# EAGLE schematic cyberspace-1-mainboard (EAGLE 9.6.2)
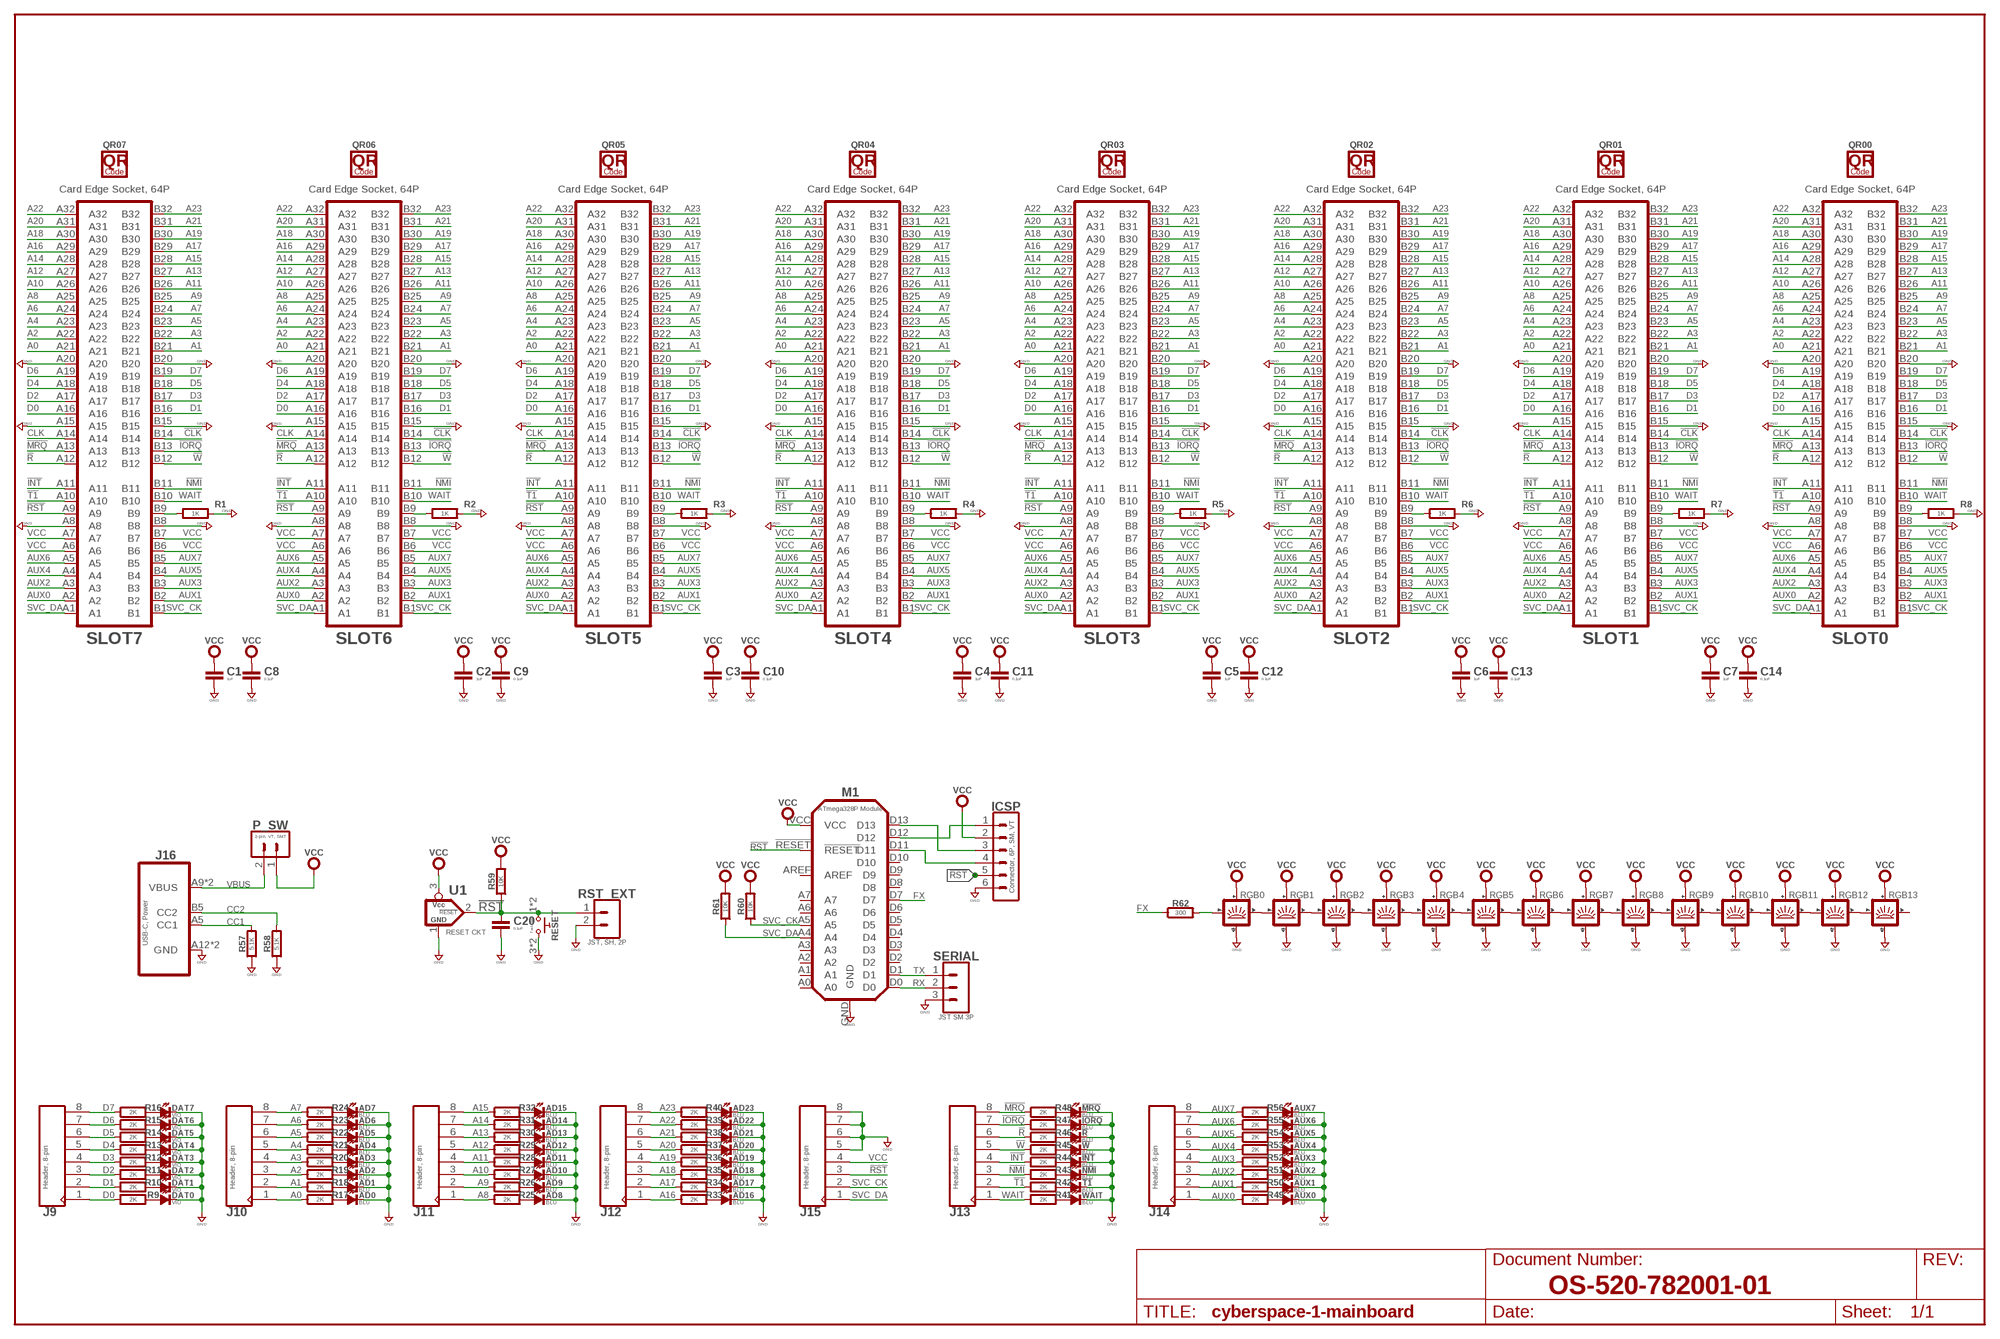
[diagram p0: schematic, sheet 1]
FRAME1 (TABL_L): DOCUMENT_NUMBER: OS-520-782001-01

## Parts
!INT  BLU  SMT0603  [SMD_0603]
!IORQ  BLU  SMT0603  [SMD_0603]
!MRQ  BLU  SMT0603  [SMD_0603]
!NMI  BLU  SMT0603  [SMD_0603]
!R  BLU  SMT0603  [SMD_0603]
!T1  BLU  SMT0603  [SMD_0603]
!W  BLU  SMT0603  [SMD_0603]
AD0  BLU  SMT0603  [SMD_0603]
AD1  BLU  SMT0603  [SMD_0603]
AD2  BLU  SMT0603  [SMD_0603]
AD3  BLU  SMT0603  [SMD_0603]
AD4  BLU  SMT0603  [SMD_0603]
AD5  BLU  SMT0603  [SMD_0603]
AD6  BLU  SMT0603  [SMD_0603]
AD7  BLU  SMT0603  [SMD_0603]
AD8  BLU  SMT0603  [SMD_0603]
AD9  BLU  SMT0603  [SMD_0603]
AD10  BLU  SMT0603  [SMD_0603]
AD11  BLU  SMT0603  [SMD_0603]
AD12  BLU  SMT0603  [SMD_0603]
AD13  BLU  SMT0603  [SMD_0603]
AD14  BLU  SMT0603  [SMD_0603]
AD15  BLU  SMT0603  [SMD_0603]
AD16  BLU  SMT0603  [SMD_0603]
AD17  BLU  SMT0603  [SMD_0603]
AD18  BLU  SMT0603  [SMD_0603]
AD19  BLU  SMT0603  [SMD_0603]
AD20  BLU  SMT0603  [SMD_0603]
AD21  BLU  SMT0603  [SMD_0603]
AD22  BLU  SMT0603  [SMD_0603]
AD23  BLU  SMT0603  [SMD_0603]
AUX0  BLU  SMT0603  [SMD_0603]
AUX1  BLU  SMT0603  [SMD_0603]
AUX2  BLU  SMT0603  [SMD_0603]
AUX3  BLU  SMT0603  [SMD_0603]
AUX4  BLU  SMT0603  [SMD_0603]
AUX5  BLU  SMT0603  [SMD_0603]
AUX6  BLU  SMT0603  [SMD_0603]
AUX7  BLU  SMT0603  [SMD_0603]
C1  1uF  CAPACITOR0603  [0603-CAP]
C2  1uF  CAPACITOR0603  [0603-CAP]
C3  1uF  CAPACITOR0603  [0603-CAP]
C4  1uF  CAPACITOR0603  [0603-CAP]
C5  1uF  CAPACITOR0603  [0603-CAP]
C6  1uF  CAPACITOR0603  [0603-CAP]
C7  1uF  CAPACITOR0603  [0603-CAP]
C8  0.1uF  CAPACITOR0603  [0603-CAP]
C9  0.1uF  CAPACITOR0603  [0603-CAP]
C10  0.1uF  CAPACITOR0603  [0603-CAP]
C11  0.1uF  CAPACITOR0603  [0603-CAP]
C12  0.1uF  CAPACITOR0603  [0603-CAP]
C13  0.1uF  CAPACITOR0603  [0603-CAP]
C14  0.1uF  CAPACITOR0603  [0603-CAP]
C20  0.1uF  CAPACITOR0603  [0603-CAP]
DAT0  VIO  SMT0603  [SMD_0603]
DAT1  VIO  SMT0603  [SMD_0603]
DAT2  VIO  SMT0603  [SMD_0603]
DAT3  VIO  SMT0603  [SMD_0603]
DAT4  VIO  SMT0603  [SMD_0603]
DAT5  VIO  SMT0603  [SMD_0603]
DAT6  VIO  SMT0603  [SMD_0603]
DAT7  VIO  SMT0603  [SMD_0603]
ICSP  Connector, 6P, SM, VT  06P-SM-VT-SMT  [BM06B-SRSS-TB]
J9  Header, 8-pin  CON_08X1-VT-THD  [MA08X1-VT-THD]
J10  Header, 8-pin  CON_08X1-VT-THD  [MA08X1-VT-THD]
J11  Header, 8-pin  CON_08X1-VT-THD  [MA08X1-VT-THD]
J12  Header, 8-pin  CON_08X1-VT-THD  [MA08X1-VT-THD]
J13  Header, 8-pin  CON_08X1-VT-THD  [MA08X1-VT-THD]
J14  Header, 8-pin  CON_08X1-VT-THD  [MA08X1-VT-THD]
J15  Header, 8-pin  CON_08X1-VT-THD  [MA08X1-VT-THD]
J16  USB-C, Power  USB-C-PWRSMT-HORIZ  [GCT-USB4125]
M1  ATmega328P Module  0119REV-A  [0119A]
P_SW  2-pin, VT, SMT  02PVT-SMT  [B2B-PH-SM4]
QR00  QR_CODE-00-7MM  [QR-7MM-00]
QR01  QR_CODE-01-7MM  [QR-7MM-01]
QR02  QR_CODE-02-7MM  [QR-7MM-02]
QR03  QR_CODE-03-7MM  [QR-7MM-03]
QR04  QR_CODE-04-7MM  [QR-7MM-04]
QR05  QR_CODE-05-7MM  [QR-7MM-05]
QR06  QR_CODE-06-7MM  [QR-7MM-06]
QR07  QR_CODE-07-7MM  [QR-7MM-07]
R1  1K  RESISTOR0603  [0603-RES]
R2  1K  RESISTOR0603  [0603-RES]
R3  1K  RESISTOR0603  [0603-RES]
R4  1K  RESISTOR0603  [0603-RES]
R5  1K  RESISTOR0603  [0603-RES]
R6  1K  RESISTOR0603  [0603-RES]
R7  1K  RESISTOR0603  [0603-RES]
R8  1K  RESISTOR0603  [0603-RES]
R9  2K  RESISTOR0603  [0603-RES]
R10  2K  RESISTOR0603  [0603-RES]
R11  2K  RESISTOR0603  [0603-RES]
R12  2K  RESISTOR0603  [0603-RES]
R13  2K  RESISTOR0603  [0603-RES]
R14  2K  RESISTOR0603  [0603-RES]
R15  2K  RESISTOR0603  [0603-RES]
R16  2K  RESISTOR0603  [0603-RES]
R17  2K  RESISTOR0603  [0603-RES]
R18  2K  RESISTOR0603  [0603-RES]
R19  2K  RESISTOR0603  [0603-RES]
R20  2K  RESISTOR0603  [0603-RES]
R21  2K  RESISTOR0603  [0603-RES]
R22  2K  RESISTOR0603  [0603-RES]
R23  2K  RESISTOR0603  [0603-RES]
R24  2K  RESISTOR0603  [0603-RES]
R25  2K  RESISTOR0603  [0603-RES]
R26  2K  RESISTOR0603  [0603-RES]
R27  2K  RESISTOR0603  [0603-RES]
R28  2K  RESISTOR0603  [0603-RES]
R29  2K  RESISTOR0603  [0603-RES]
R30  2K  RESISTOR0603  [0603-RES]
R31  2K  RESISTOR0603  [0603-RES]
R32  2K  RESISTOR0603  [0603-RES]
R33  2K  RESISTOR0603  [0603-RES]
R34  2K  RESISTOR0603  [0603-RES]
R35  2K  RESISTOR0603  [0603-RES]
R36  2K  RESISTOR0603  [0603-RES]
R37  2K  RESISTOR0603  [0603-RES]
R38  2K  RESISTOR0603  [0603-RES]
R39  2K  RESISTOR0603  [0603-RES]
R40  2K  RESISTOR0603  [0603-RES]
R41  2K  RESISTOR0603  [0603-RES]
R42  2K  RESISTOR0603  [0603-RES]
R43  2K  RESISTOR0603  [0603-RES]
R44  2K  RESISTOR0603  [0603-RES]
R45  2K  RESISTOR0603  [0603-RES]
R46  2K  RESISTOR0603  [0603-RES]
R47  2K  RESISTOR0603  [0603-RES]
R48  2K  RESISTOR0603  [0603-RES]
R49  2K  RESISTOR0603  [0603-RES]
R50  2K  RESISTOR0603  [0603-RES]
R51  2K  RESISTOR0603  [0603-RES]
R52  2K  RESISTOR0603  [0603-RES]
R53  2K  RESISTOR0603  [0603-RES]
R54  2K  RESISTOR0603  [0603-RES]
R55  2K  RESISTOR0603  [0603-RES]
R56  2K  RESISTOR0603  [0603-RES]
R57  5.1K  RESISTOR0603  [0603-RES]
R58  5.1K  RESISTOR0603  [0603-RES]
R59  10K  RESISTOR0603  [0603-RES]
R60  10K  RESISTOR0603  [0603-RES]
R61  10K  RESISTOR0603  [0603-RES]
R62  300  RESISTOR0603  [0603-RES]
RESET  Tact. Sw.  PUSHBTN-MOMB3FS  [B3FS]
RGB0  SMART_LED4020-SIDE  [SMD_4020]
RGB1  SMART_LED4020-SIDE  [SMD_4020]
RGB2  SMART_LED4020-SIDE  [SMD_4020]
RGB3  SMART_LED4020-SIDE  [SMD_4020]
RGB4  SMART_LED4020-SIDE  [SMD_4020]
RGB5  SMART_LED4020-SIDE  [SMD_4020]
RGB6  SMART_LED4020-SIDE  [SMD_4020]
RGB7  SMART_LED4020-SIDE  [SMD_4020]
RGB8  SMART_LED4020-SIDE  [SMD_4020]
RGB9  SMART_LED4020-SIDE  [SMD_4020]
RGB10  SMART_LED4020-SIDE  [SMD_4020]
RGB11  SMART_LED4020-SIDE  [SMD_4020]
RGB12  SMART_LED4020-SIDE  [SMD_4020]
RGB13  SMART_LED4020-SIDE  [SMD_4020]
RST_EXT  JST, SH, 2P  02P-SM-VT-SMT  [BM02B-SRSS-TB]
SERIAL  JST SM 3P  03P-SM-VT-SMT  [BM03B-SRSS-TB]
SLOT0  Card Edge Socket, 64P  PCIE-64-SOCKET  [PCIE-64P-SOCKET]
SLOT1  Card Edge Socket, 64P  PCIE-64-SOCKET  [PCIE-64P-SOCKET]
SLOT2  Card Edge Socket, 64P  PCIE-64-SOCKET  [PCIE-64P-SOCKET]
SLOT3  Card Edge Socket, 64P  PCIE-64-SOCKET  [PCIE-64P-SOCKET]
SLOT4  Card Edge Socket, 64P  PCIE-64-SOCKET  [PCIE-64P-SOCKET]
SLOT5  Card Edge Socket, 64P  PCIE-64-SOCKET  [PCIE-64P-SOCKET]
SLOT6  Card Edge Socket, 64P  PCIE-64-SOCKET  [PCIE-64P-SOCKET]
SLOT7  Card Edge Socket, 64P  PCIE-64-SOCKET  [PCIE-64P-SOCKET]
U1  RESET CKT  RESET_CIRCUITAPX803S-SA  [SOT-23]
WAIT  BLU  SMT0603  [SMD_0603]

## Nets
!CLK: SLOT0.B14 SLOT1.B14 SLOT2.B14 SLOT3.B14 SLOT4.B14 SLOT5.B14 SLOT6.B14 SLOT7.B14
!INT: J13.4 R44.1 SLOT0.A11 SLOT1.A11 SLOT2.A11 SLOT3.A11 SLOT4.A11 SLOT5.A11 SLOT6.A11 SLOT7.A11
!IORQ: J13.7 R47.1 SLOT0.B13 SLOT1.B13 SLOT2.B13 SLOT3.B13 SLOT4.B13 SLOT5.B13 SLOT6.B13 SLOT7.B13
!MRQ: J13.8 R48.1 SLOT0.A13 SLOT1.A13 SLOT2.A13 SLOT3.A13 SLOT4.A13 SLOT5.A13 SLOT6.A13 SLOT7.A13
!NMI: J13.3 R43.1 SLOT0.B11 SLOT1.B11 SLOT2.B11 SLOT3.B11 SLOT4.B11 SLOT5.B11 SLOT6.B11 SLOT7.B11
!R: J13.6 R46.1 SLOT0.A12 SLOT1.A12 SLOT2.A12 SLOT3.A12 SLOT4.A12 SLOT5.A12 SLOT6.A12 SLOT7.A12
!RST: C20.1 ICSP.5 J15.3 M1.!RESET R59.1 RESET.1 RESET.2 RST_EXT.1 SLOT0.A9 SLOT1.A9 SLOT2.A9 SLOT3.A9 SLOT4.A9 SLOT5.A9 SLOT6.A9 SLOT7.A9 U1.2(!RST)
!T1: J13.2 R42.1 SLOT0.A10 SLOT1.A10 SLOT2.A10 SLOT3.A10 SLOT4.A10 SLOT5.A10 SLOT6.A10 SLOT7.A10
!W: J13.5 R45.1 SLOT0.B12 SLOT1.B12 SLOT2.B12 SLOT3.B12 SLOT4.B12 SLOT5.B12 SLOT6.B12 SLOT7.B12
A0: J10.1 R17.1 SLOT0.A21 SLOT1.A21 SLOT2.A21 SLOT3.A21 SLOT4.A21 SLOT5.A21 SLOT6.A21 SLOT7.A21
A1: J10.2 R18.1 SLOT0.B21 SLOT1.B21 SLOT2.B21 SLOT3.B21 SLOT4.B21 SLOT5.B21 SLOT6.B21 SLOT7.B21
A2: J10.3 R19.1 SLOT0.A22 SLOT1.A22 SLOT2.A22 SLOT3.A22 SLOT4.A22 SLOT5.A22 SLOT6.A22 SLOT7.A22
A3: J10.4 R20.1 SLOT0.B22 SLOT1.B22 SLOT2.B22 SLOT3.B22 SLOT4.B22 SLOT5.B22 SLOT6.B22 SLOT7.B22
A4: J10.5 R21.1 SLOT0.A23 SLOT1.A23 SLOT2.A23 SLOT3.A23 SLOT4.A23 SLOT5.A23 SLOT6.A23 SLOT7.A23
A5: J10.6 R22.1 SLOT0.B23 SLOT1.B23 SLOT2.B23 SLOT3.B23 SLOT4.B23 SLOT5.B23 SLOT6.B23 SLOT7.B23
A6: J10.7 R23.1 SLOT0.A24 SLOT1.A24 SLOT2.A24 SLOT3.A24 SLOT4.A24 SLOT5.A24 SLOT6.A24 SLOT7.A24
A7: J10.8 R24.1 SLOT0.B24 SLOT1.B24 SLOT2.B24 SLOT3.B24 SLOT4.B24 SLOT5.B24 SLOT6.B24 SLOT7.B24
A8: J11.1 R25.1 SLOT0.A25 SLOT1.A25 SLOT2.A25 SLOT3.A25 SLOT4.A25 SLOT5.A25 SLOT6.A25 SLOT7.A25
A9: J11.2 R26.1 SLOT0.B25 SLOT1.B25 SLOT2.B25 SLOT3.B25 SLOT4.B25 SLOT5.B25 SLOT6.B25 SLOT7.B25
A10: J11.3 R27.1 SLOT0.A26 SLOT1.A26 SLOT2.A26 SLOT3.A26 SLOT4.A26 SLOT5.A26 SLOT6.A26 SLOT7.A26
A11: J11.4 R28.1 SLOT0.B26 SLOT1.B26 SLOT2.B26 SLOT3.B26 SLOT4.B26 SLOT5.B26 SLOT6.B26 SLOT7.B26
A12: J11.5 R29.1 SLOT0.A27 SLOT1.A27 SLOT2.A27 SLOT3.A27 SLOT4.A27 SLOT5.A27 SLOT6.A27 SLOT7.A27
A13: J11.6 R30.1 SLOT0.B27 SLOT1.B27 SLOT2.B27 SLOT3.B27 SLOT4.B27 SLOT5.B27 SLOT6.B27 SLOT7.B27
A14: J11.7 R31.1 SLOT0.A28 SLOT1.A28 SLOT2.A28 SLOT3.A28 SLOT4.A28 SLOT5.A28 SLOT6.A28 SLOT7.A28
A15: J11.8 R32.1 SLOT0.B28 SLOT1.B28 SLOT2.B28 SLOT3.B28 SLOT4.B28 SLOT5.B28 SLOT6.B28 SLOT7.B28
A16: J12.1 R33.1 SLOT0.A29 SLOT1.A29 SLOT2.A29 SLOT3.A29 SLOT4.A29 SLOT5.A29 SLOT6.A29 SLOT7.A29
A17: J12.2 R34.1 SLOT0.B29 SLOT1.B29 SLOT2.B29 SLOT3.B29 SLOT4.B29 SLOT5.B29 SLOT6.B29 SLOT7.B29
A18: J12.3 R35.1 SLOT0.A30 SLOT1.A30 SLOT2.A30 SLOT3.A30 SLOT4.A30 SLOT5.A30 SLOT6.A30 SLOT7.A30
A19: J12.4 R36.1 SLOT0.B30 SLOT1.B30 SLOT2.B30 SLOT3.B30 SLOT4.B30 SLOT5.B30 SLOT6.B30 SLOT7.B30
A20: J12.5 R37.1 SLOT0.A31 SLOT1.A31 SLOT2.A31 SLOT3.A31 SLOT4.A31 SLOT5.A31 SLOT6.A31 SLOT7.A31
A21: J12.6 R38.1 SLOT0.B31 SLOT1.B31 SLOT2.B31 SLOT3.B31 SLOT4.B31 SLOT5.B31 SLOT6.B31 SLOT7.B31
A22: J12.7 R39.1 SLOT0.A32 SLOT1.A32 SLOT2.A32 SLOT3.A32 SLOT4.A32 SLOT5.A32 SLOT6.A32 SLOT7.A32
A23: J12.8 R40.1 SLOT0.B32 SLOT1.B32 SLOT2.B32 SLOT3.B32 SLOT4.B32 SLOT5.B32 SLOT6.B32 SLOT7.B32
AUX0: J14.1 R49.1 SLOT0.A2 SLOT1.A2 SLOT2.A2 SLOT3.A2 SLOT4.A2 SLOT5.A2 SLOT6.A2 SLOT7.A2
AUX1: J14.2 R50.1 SLOT0.B2 SLOT1.B2 SLOT2.B2 SLOT3.B2 SLOT4.B2 SLOT5.B2 SLOT6.B2 SLOT7.B2
AUX2: J14.3 R51.1 SLOT0.A3 SLOT1.A3 SLOT2.A3 SLOT3.A3 SLOT4.A3 SLOT5.A3 SLOT6.A3 SLOT7.A3
AUX3: J14.4 R52.1 SLOT0.B3 SLOT1.B3 SLOT2.B3 SLOT3.B3 SLOT4.B3 SLOT5.B3 SLOT6.B3 SLOT7.B3
AUX4: J14.5 R53.1 SLOT0.A4 SLOT1.A4 SLOT2.A4 SLOT3.A4 SLOT4.A4 SLOT5.A4 SLOT6.A4 SLOT7.A4
AUX5: J14.6 R54.1 SLOT0.B4 SLOT1.B4 SLOT2.B4 SLOT3.B4 SLOT4.B4 SLOT5.B4 SLOT6.B4 SLOT7.B4
AUX6: J14.7 R55.1 SLOT0.A5 SLOT1.A5 SLOT2.A5 SLOT3.A5 SLOT4.A5 SLOT5.A5 SLOT6.A5 SLOT7.A5
AUX7: J14.8 R56.1 SLOT0.B5 SLOT1.B5 SLOT2.B5 SLOT3.B5 SLOT4.B5 SLOT5.B5 SLOT6.B5 SLOT7.B5
CC1: J16.A5(CC1) R57.2
CC2: J16.B5(CC2) R58.2
CLK: SLOT0.A14 SLOT1.A14 SLOT2.A14 SLOT3.A14 SLOT4.A14 SLOT5.A14 SLOT6.A14 SLOT7.A14
D0: J9.1 R9.1 SLOT0.A16 SLOT1.A16 SLOT2.A16 SLOT3.A16 SLOT4.A16 SLOT5.A16 SLOT6.A16 SLOT7.A16
D1: J9.2 R10.1 SLOT0.B16 SLOT1.B16 SLOT2.B16 SLOT3.B16 SLOT4.B16 SLOT5.B16 SLOT6.B16 SLOT7.B16
D2: J9.3 R11.1 SLOT0.A17 SLOT1.A17 SLOT2.A17 SLOT3.A17 SLOT4.A17 SLOT5.A17 SLOT6.A17 SLOT7.A17
D3: J9.4 R12.1 SLOT0.B17 SLOT1.B17 SLOT2.B17 SLOT3.B17 SLOT4.B17 SLOT5.B17 SLOT6.B17 SLOT7.B17
D4: J9.5 R13.1 SLOT0.A18 SLOT1.A18 SLOT2.A18 SLOT3.A18 SLOT4.A18 SLOT5.A18 SLOT6.A18 SLOT7.A18
D5: J9.6 R14.1 SLOT0.B18 SLOT1.B18 SLOT2.B18 SLOT3.B18 SLOT4.B18 SLOT5.B18 SLOT6.B18 SLOT7.B18
D6: J9.7 R15.1 SLOT0.A19 SLOT1.A19 SLOT2.A19 SLOT3.A19 SLOT4.A19 SLOT5.A19 SLOT6.A19 SLOT7.A19
D7: J9.8 R16.1 SLOT0.B19 SLOT1.B19 SLOT2.B19 SLOT3.B19 SLOT4.B19 SLOT5.B19 SLOT6.B19 SLOT7.B19
FX: M1.D7 R62.1
GND: !INT.K(C) !IORQ.K(C) !MRQ.K(C) !NMI.K(C) !R.K(C) !T1.K(C) !W.K(C) AD0.K(C) AD1.K(C) AD2.K(C) AD3.K(C) AD4.K(C) AD5.K(C) AD6.K(C) AD7.K(C) AD8.K(C) AD9.K(C) AD10.K(C) AD11.K(C) AD12.K(C) AD13.K(C) AD14.K(C) AD15.K(C) AD16.K(C) AD17.K(C) AD18.K(C) AD19.K(C) AD20.K(C) AD21.K(C) AD22.K(C) AD23.K(C) AUX0.K(C) AUX1.K(C) AUX2.K(C) AUX3.K(C) AUX4.K(C) AUX5.K(C) AUX6.K(C) AUX7.K(C) C1.2 C2.2 C3.2 C4.2 C5.2 C6.2 C7.2 C8.2 C9.2 C10.2 C11.2 C12.2 C13.2 C14.2 C20.2 DAT0.K(C) DAT1.K(C) DAT2.K(C) DAT3.K(C) DAT4.K(C) DAT5.K(C) DAT6.K(C) DAT7.K(C) ICSP.6 J15.5 J15.6 J15.7 J15.8 J16.A12(GND) J16.B12(GND) M1.GND R1.2 R2.2 R3.2 R4.2 R5.2 R6.2 R7.2 R8.2 R57.1 R58.1 RESET.3 RESET.4 RGB0.4(GND) RGB1.4(GND) RGB2.4(GND) RGB3.4(GND) RGB4.4(GND) RGB5.4(GND) RGB6.4(GND) RGB7.4(GND) RGB8.4(GND) RGB9.4(GND) RGB10.4(GND) RGB11.4(GND) RGB12.4(GND) RGB13.4(GND) RST_EXT.2 SERIAL.3 SLOT0.A8 SLOT0.A15 SLOT0.A20 SLOT0.B8 SLOT0.B15 SLOT0.B20 SLOT1.A8 SLOT1.A15 SLOT1.A20 SLOT1.B8 SLOT1.B15 SLOT1.B20 SLOT2.A8 SLOT2.A15 SLOT2.A20 SLOT2.B8 SLOT2.B15 SLOT2.B20 SLOT3.A8 SLOT3.A15 SLOT3.A20 SLOT3.B8 SLOT3.B15 SLOT3.B20 SLOT4.A8 SLOT4.A15 SLOT4.A20 SLOT4.B8 SLOT4.B15 SLOT4.B20 SLOT5.A8 SLOT5.A15 SLOT5.A20 SLOT5.B8 SLOT5.B15 SLOT5.B20 SLOT6.A8 SLOT6.A15 SLOT6.A20 SLOT6.B8 SLOT6.B15 SLOT6.B20 SLOT7.A8 SLOT7.A15 SLOT7.A20 SLOT7.B8 SLOT7.B15 SLOT7.B20 U1.1(GND) WAIT.K(C)
MISO: ICSP.1 M1.D12
MOSI: ICSP.4 M1.D11
N$1: R1.1 SLOT7.B9
N$2: DAT0.A R9.2
N$3: DAT1.A R10.2
N$4: DAT2.A R11.2
N$5: DAT3.A R12.2
N$6: DAT4.A R13.2
N$7: DAT5.A R14.2
N$8: DAT6.A R15.2
N$9: R2.1 SLOT6.B9
N$10: DAT7.A R16.2
N$11: R3.1 SLOT5.B9
N$12: AD0.A R17.2
N$13: R4.1 SLOT4.B9
N$14: AD1.A R18.2
N$15: R5.1 SLOT3.B9
N$16: AD2.A R19.2
N$17: R6.1 SLOT2.B9
N$18: AD3.A R20.2
N$19: R7.1 SLOT1.B9
N$20: AD4.A R21.2
N$21: R8.1 SLOT0.B9
N$22: AD5.A R22.2
N$23: AD6.A R23.2
N$24: AD7.A R24.2
N$25: AD8.A R25.2
N$26: AD9.A R26.2
N$27: AD10.A R27.2
N$28: AD11.A R28.2
N$29: AD12.A R29.2
N$30: AD13.A R30.2
N$31: AD14.A R31.2
N$32: AD15.A R32.2
N$33: AD16.A R33.2
N$34: AD17.A R34.2
N$35: AD18.A R35.2
N$36: AD19.A R36.2
N$37: AD20.A R37.2
N$38: AD21.A R38.2
N$39: AD22.A R39.2
N$40: AD23.A R40.2
N$41: R41.2 WAIT.A
N$42: !T1.A R42.2
N$43: !NMI.A R43.2
N$44: !INT.A R44.2
N$45: !W.A R45.2
N$46: !R.A R46.2
N$47: !IORQ.A R47.2
N$48: !MRQ.A R48.2
N$49: AUX0.A R49.2
N$50: AUX1.A R50.2
N$51: AUX2.A R51.2
N$52: AUX3.A R52.2
N$53: AUX4.A R53.2
N$54: AUX5.A R54.2
N$55: AUX6.A R55.2
N$56: AUX7.A R56.2
N$57: RGB0.3(OUT) RGB1.1(IN)
N$58: RGB1.3(OUT) RGB2.1(IN)
N$59: RGB2.3(OUT) RGB3.1(IN)
N$60: RGB3.3(OUT) RGB4.1(IN)
N$61: RGB4.3(OUT) RGB5.1(IN)
N$62: RGB5.3(OUT) RGB6.1(IN)
N$63: RGB6.3(OUT) RGB7.1(IN)
N$64: RGB7.3(OUT) RGB8.1(IN)
N$65: RGB8.3(OUT) RGB9.1(IN)
N$66: RGB9.3(OUT) RGB10.1(IN)
N$67: RGB10.3(OUT) RGB11.1(IN)
N$68: RGB11.3(OUT) RGB12.1(IN)
N$69: RGB12.3(OUT) RGB13.1(IN)
N$70: R62.2 RGB0.1(IN)
RX: M1.D0 SERIAL.2
SCK: ICSP.3 M1.D13
SVC_CK: J15.2 M1.A5 R60.1 SLOT0.B1 SLOT1.B1 SLOT2.B1 SLOT3.B1 SLOT4.B1 SLOT5.B1 SLOT6.B1 SLOT7.B1
SVC_DA: J15.1 M1.A4 R61.1 SLOT0.A1 SLOT1.A1 SLOT2.A1 SLOT3.A1 SLOT4.A1 SLOT5.A1 SLOT6.A1 SLOT7.A1
TX: M1.D1 SERIAL.1
VBUS: J16.A9(VBUS) J16.B9(VBUS) P_SW.2
VCC: C1.1 C2.1 C3.1 C4.1 C5.1 C6.1 C7.1 C8.1 C9.1 C10.1 C11.1 C12.1 C13.1 C14.1 ICSP.2 J15.4 M1.VCC P_SW.1 R59.2 R60.2 R61.2 RGB0.2(VDD) RGB1.2(VDD) RGB2.2(VDD) RGB3.2(VDD) RGB4.2(VDD) RGB5.2(VDD) RGB6.2(VDD) RGB7.2(VDD) RGB8.2(VDD) RGB9.2(VDD) RGB10.2(VDD) RGB11.2(VDD) RGB12.2(VDD) RGB13.2(VDD) SLOT0.A6 SLOT0.A7 SLOT0.B6 SLOT0.B7 SLOT1.A6 SLOT1.A7 SLOT1.B6 SLOT1.B7 SLOT2.A6 SLOT2.A7 SLOT2.B6 SLOT2.B7 SLOT3.A6 SLOT3.A7 SLOT3.B6 SLOT3.B7 SLOT4.A6 SLOT4.A7 SLOT4.B6 SLOT4.B7 SLOT5.A6 SLOT5.A7 SLOT5.B6 SLOT5.B7 SLOT6.A6 SLOT6.A7 SLOT6.B6 SLOT6.B7 SLOT7.A6 SLOT7.A7 SLOT7.B6 SLOT7.B7 U1.3(VCC)
WAIT: J13.1 R41.1 SLOT0.B10 SLOT1.B10 SLOT2.B10 SLOT3.B10 SLOT4.B10 SLOT5.B10 SLOT6.B10 SLOT7.B10
Unconnected: M1.A0 M1.A1 M1.A2 M1.A3 M1.A6 M1.A7 M1.AREF M1.D2 M1.D3 M1.D4 M1.D5 M1.D6 M1.D8 M1.D9 M1.D10 RGB13.3(OUT)

## Library data of the parts
!INT !IORQ !MRQ !NMI !R !T1 !W AD0 AD1-AD23 AUX0 AUX1-AUX7 DAT0 DAT1-DAT7 WAIT = led:SMT: LED SMT; COST01: 0.20; COST10: 0.17; COST100: 0.14
C1-C14 C20 = rlc:CAPACITOR: Capacitor; COST01: 0.12; COST10: 0.09; COST100: 0.05
ICSP = con-jst:06P: Connector, 6P; COST01: 0.60; COST10: 0.52; COST100: 0.49; MFR: JST; MPN: BM06-SRSS-TB
J9-J15 = con-headers:CON_08X1: Header, 8-pin, 1-row, 2.54mm; COST01: 0.14
J16 = con-usb:USB-C-PWR: USB-C, Power Only; COST01: 0.70; COST10: 0.55; COST100: 0.42; MFR: GCT; MPN: USB4125
M1 = circuit-monkey-chips:0119: Circuit Monkey #0119 - ATmega328P Module; COST01: 18.38; COST10: 13.22; COST100: 9.09; MFR: Circuit Monkey; MPN: 0119A
P_SW = con-jst:02P: 2 pin connector; COST01: 0.76; COST10: 0.66; COST100: 0.56; MFR: JST; MPN: B2B-PH-SM4
QR00 QR01-QR07 = gfx-glyphs:QR_CODE: QR Code
R1-R62 = rlc:RESISTOR: Resistor; COST01: 0.10; COST10: 0.05; COST100: 0.02
RESET = switch-smd:PUSHBTN-MOM: Pushbutton Switch; MFR: Omron; MPN: B3FS-10*
RGB0 RGB1-RGB13 = led:SMART_LED: Smart LED SK6812 WS2812; COST01: 0.60; COST10: 0.50; COST100: 0.40
RST_EXT = con-jst:02P: 2 pin connector; COST01: 0.45; COST10: 0.4; COST100: 0.35; MFR: JST; MPN: BMB02B-SRSS-TB
SERIAL = con-jst:03P: 3 pin connector; COST01: 0.60; COST10: 0.45; COST100: 0.38; MFR: JST; MPN: BM03B-SRSS-TB
SLOT0 SLOT1-SLOT7 = con-edge:PCIE-64: PCIE 36 pin connector; COST01: 0.77; COST10: 0.66; COST100: 0.44; MFR: FCI; MPN: 10018784-xxx01
U1 = logic:RESET_CIRCUIT: Microprocessor Reset Circuit; COST01: 0.40; COST10: 0.30; COST100: 0.18; MFR: Diodes Inc.; MPN: APX803L40-47SA